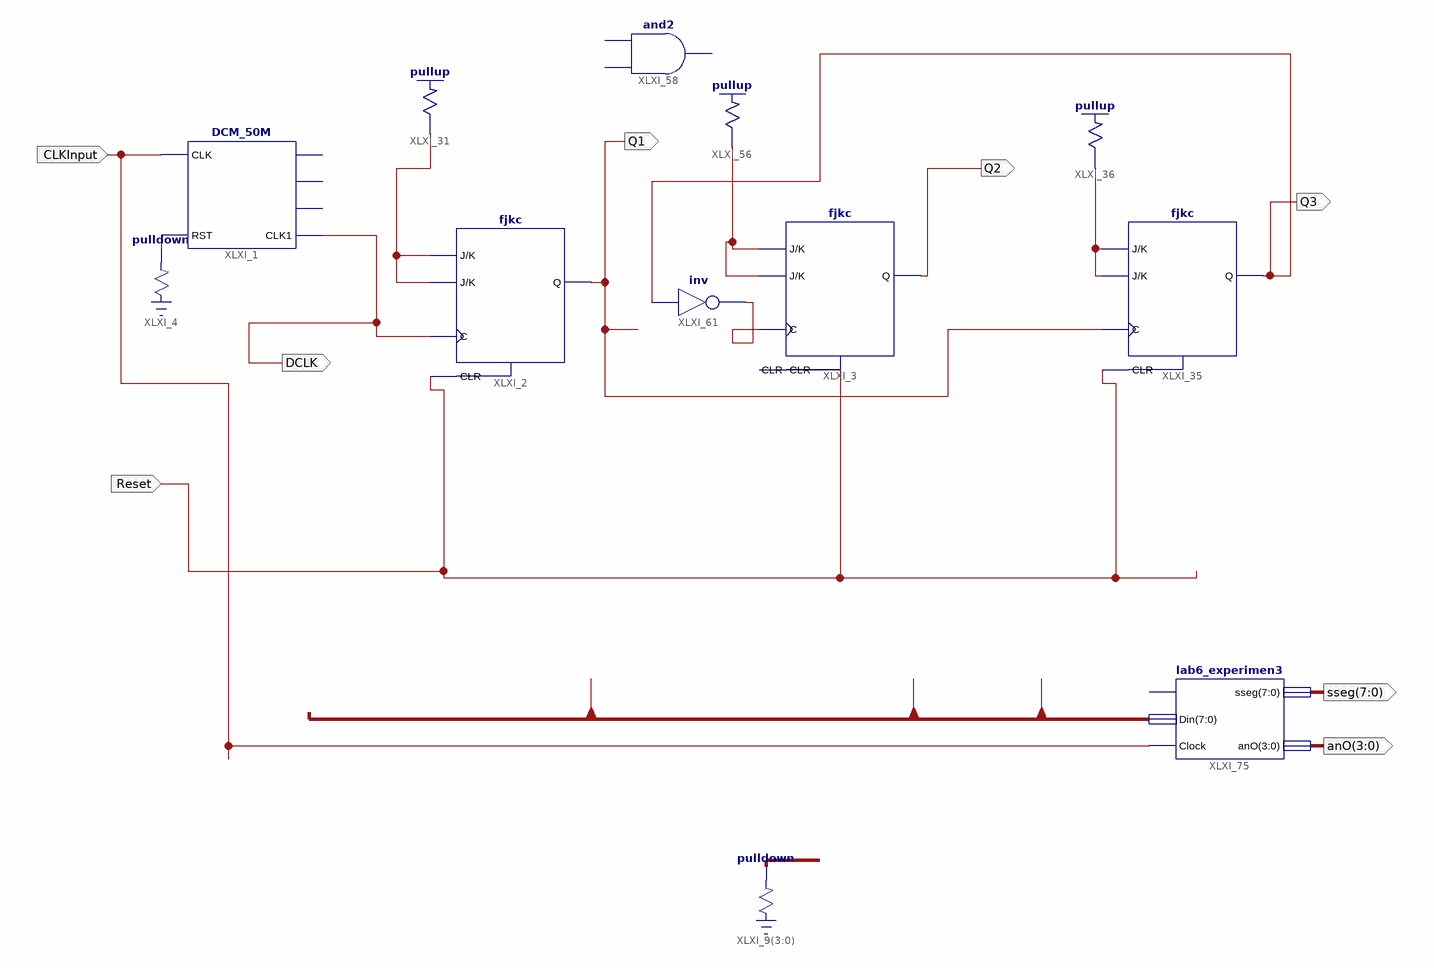
[diagram p0: schematic sheet 1]
// Xilinx ISE schematic lab8_starter.sch (spartan3e) as structural Verilog: 12 symbols, 8 ports
module lab8_starter (
  input  Reset,
  input  CLKInput,
  output DCLK,
  output Q3,
  output Q2,
  output Q1,
  output [7:0] sseg,
  output [3:0] anO
);

  wire XLXN_38, XLXN_39, XLXN_48, XLXN_91, XLXN_94;
  wire [7:0] Din;
  wire [7:4] Dout;

  DCM_50M XLXI_1 (.CLK(CLKInput), .RST(XLXN_38), .CLK1(DCLK));  // open: CLK1M, CLK10k, CLK1k
  fjkc XLXI_2 (.C(DCLK), .CLR(Reset), .J(XLXN_39), .K(XLXN_39), .Q(Q1));
  fjkc XLXI_3 (.C(XLXN_94), .CLR(Reset), .J(XLXN_91), .K(XLXN_91), .Q(Q2));
  \pulldown  XLXI_4 (.O(XLXN_38));
  \pullup  XLXI_31 (.O(XLXN_39));
  fjkc XLXI_35 (.C(Q1), .CLR(Reset), .J(XLXN_48), .K(XLXN_48), .Q(Q3));
  \pullup  XLXI_36 (.O(XLXN_48));
  \pullup  XLXI_56 (.O(XLXN_91));
  not XLXI_61 (XLXN_94, Q3);
  // and2 XLXI_58 is placed but not wired
  lab6_experimen3 XLXI_75 (.Din(Din), .Clock(CLKInput), .sseg(sseg), .anO(anO));  // open: En
  \pulldown  XLXI_9[3:0] (.O(Dout));
endmodule
